# Altium project DRIVER.PrjPcb (part 2 of 4)

## Sheet 2_INTERFACES_EXTERNAS.SchDoc
size Tabloid; SheetNumber: 2; SheetTotal: 5; SPICEModelCacheOXJGALYG: <root> / <DocumentId>OXJGALYG</DocumentId> / <CacheFrame Number="0"> / <Model Name="0603_885012206052_1uf" Kind="CKT"> / <Text>******* / .subckt 0603_885012206052_1uF 1 2 / Rser 1 3 0.00742821402486 / Lser 2 4 2.51142993E-10 / C1 3 4 0.000001 / Rpar 3 4 100000000 / .ends 0603_885012206052_1uF</Text> / </Model> / </CacheFrame> / </root>
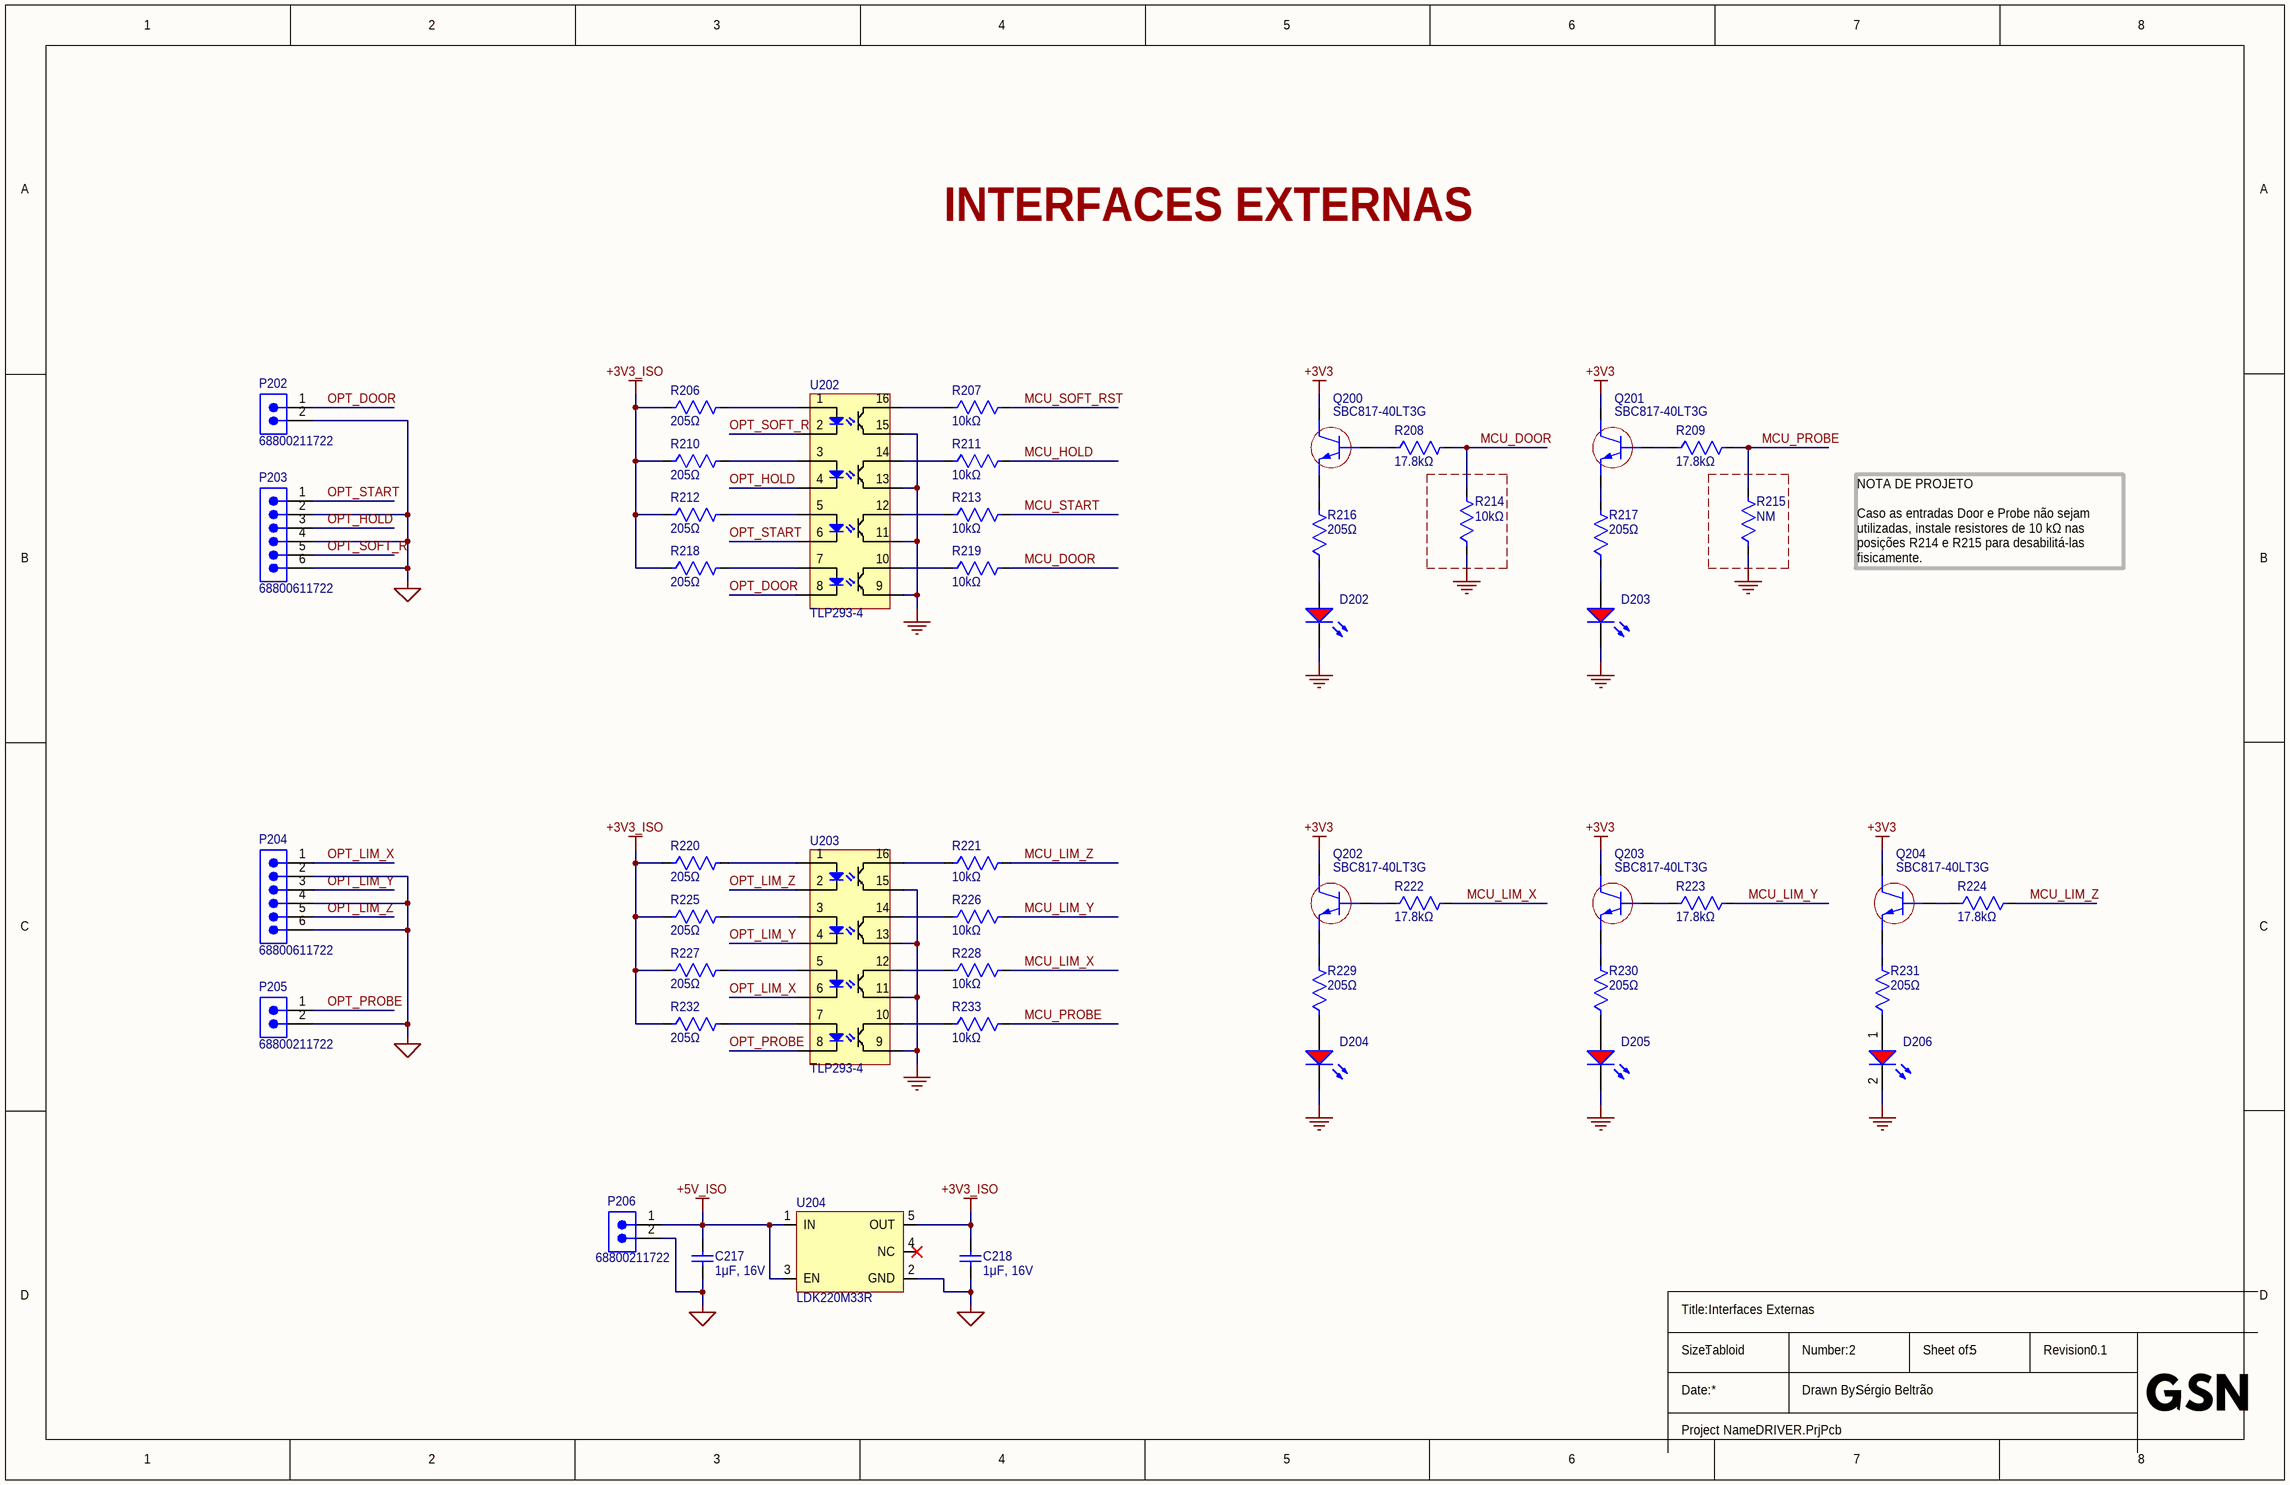
[diagram p1: 2_INTERFACES_EXTERNAS.SchDoc]

### Parts
C217  1μF, 16V  [WCAP-CSGP_0603_L1.6W0.8H0.8_Wave]
C218  1μF, 16V  [WCAP-CSGP_0603_L1.6W0.8H0.8_Wave]
D202  Red, 2V, 140deg  [WL-SMCW_0603_150060xx75003]  (value not drawn)
D203  Red, 2V, 140deg  [WL-SMCW_0603_150060xx75003]  (value not drawn)
D204  Red, 2V, 140deg  [WL-SMCW_0603_150060xx75003]  (value not drawn)
D205  Red, 2V, 140deg  [WL-SMCW_0603_150060xx75003]  (value not drawn)
D206  Red, 2V, 140deg  [WL-SMCW_0603_150060xx75003]  (value not drawn)
P202  68800211722  [68800211722]
P203  68800611722  [68800611722]
P204  68800611722  [68800611722]
P205  68800211722  [68800211722]
P206  68800211722  [68800211722]
Q200  SBC817-40LT3G  [SOT-23-3]
Q201  SBC817-40LT3G  [SOT-23-3]
Q202  SBC817-40LT3G  [SOT-23-3]
Q203  SBC817-40LT3G  [SOT-23-3]
Q204  SBC817-40LT3G  [SOT-23-3]
R206  205Ω  [0603-WAVE]
R207  10kΩ  [0603-WAVE]
R208  17.8kΩ  [0603-WAVE]
R209  17.8kΩ  [0603-WAVE]
R210  205Ω  [0603-WAVE]
R211  10kΩ  [0603-WAVE]
R212  205Ω  [0603-WAVE]
R213  10kΩ  [0603-WAVE]
R214  10kΩ  [0603-WAVE]
R215  NM  [0603-WAVE]
R216  205Ω  [0603-WAVE]
R217  205Ω  [0603-WAVE]
R218  205Ω  [0603-WAVE]
R219  10kΩ  [0603-WAVE]
R220  205Ω  [0603-WAVE]
R221  10kΩ  [0603-WAVE]
R222  17.8kΩ  [0603-WAVE]
R223  17.8kΩ  [0603-WAVE]
R224  17.8kΩ  [0603-WAVE]
R225  205Ω  [0603-WAVE]
R226  10kΩ  [0603-WAVE]
R227  205Ω  [0603-WAVE]
R228  10kΩ  [0603-WAVE]
R229  205Ω  [0603-WAVE]
R230  205Ω  [0603-WAVE]
R231  205Ω  [0603-WAVE]
R232  205Ω  [0603-WAVE]
R233  10kΩ  [0603-WAVE]
U202  TLP293-4  [SO-16]
U203  TLP293-4  [SO-16]
U204  LDK220M33R  [SOT-23-5]

### Nets
+3V3: Q200.3(C) Q201.3(C) Q202.3(C) Q203.3(C) Q204.3(C)
+3V3_ISO: C218.2 R206.1 R210.1 R212.1 R218.1 R220.1 R225.1 R227.1 R232.1 U204.5(OUT)
+5V_ISO: C217.2 P206.1 U204.1(IN) U204.3(EN)
GND: D202.2(K) D203.2(K) D204.2(K) D205.2(K) D206.2(K) R214.1 R215.1 U202.9 U202.11 U202.13 U202.15 U203.9 U203.11 U203.13 U203.15
GND_ISO: C217.1 C218.1 P202.2 P203.2 P203.4 P203.6 P204.2 P204.4 P204.6 P205.2 P206.2 U204.2(GND)
MCU_DOOR: R208.2 R214.2 R219.2
MCU_HOLD: R211.2
MCU_LIM_X: R222.2 R228.2
MCU_LIM_Y: R223.2 R226.2
MCU_LIM_Z: R221.2 R224.2
MCU_PROBE: R209.2 R215.2 R233.2
MCU_SOFT_RST: R207.2
MCU_START: R213.2
OPT_DOOR: P202.1 U202.8
OPT_HOLD: P203.3 U202.4
OPT_LIM_X: P204.1 U203.6
OPT_LIM_Y: P204.3 U203.4
OPT_LIM_Z: P204.5 U203.2
OPT_PROBE: P205.1 U203.8
OPT_SOFT_R: P203.5 U202.2
OPT_START: P203.1 U202.6
NetD202_1: D202.1(A) R216.1
NetD203_1: D203.1(A) R217.1
NetD204_1: D204.1(A) R229.1
NetD205_1: D205.1(A) R230.1
NetD206_1: D206.1(A) R231.1
NetQ200_1: Q200.1(B) R208.1
NetQ200_2: Q200.2(E) R216.2
NetQ201_1: Q201.1(B) R209.1
NetQ201_2: Q201.2(E) R217.2
NetQ202_1: Q202.1(B) R222.1
NetQ202_2: Q202.2(E) R229.2
NetQ203_1: Q203.1(B) R223.1
NetQ203_2: Q203.2(E) R230.2
NetQ204_1: Q204.1(B) R224.1
NetQ204_2: Q204.2(E) R231.2
NetR206_2: R206.2 U202.1
NetR207_1: R207.1 U202.16
NetR210_2: R210.2 U202.3
NetR211_1: R211.1 U202.14
NetR212_2: R212.2 U202.5
NetR213_1: R213.1 U202.12
NetR218_2: R218.2 U202.7
NetR219_1: R219.1 U202.10
NetR220_2: R220.2 U203.1
NetR221_1: R221.1 U203.16
NetR225_2: R225.2 U203.3
NetR226_1: R226.1 U203.14
NetR227_2: R227.2 U203.5
NetR228_1: R228.1 U203.12
NetR232_2: R232.2 U203.7
NetR233_1: R233.1 U203.10

Not connected (* = marked no-connect by the designer): U204 4(NC)*

### Notes on the sheet
- INTERFACES EXTERNAS
- NOTA DE PROJETO
  Caso as entradas Door e Probe não sejam utilizadas, instale resistores de 10 kΩ nas posições R214 e R215 para desabilitá-las fisicamente.
- Interfaces Externas
- Title:
- Size:
- Tabloid
- Number:
- Sheet of:
- Revision:
- Date:
- Project Name:
- Drawn By:

### Library data of the parts
C217 C218 = 885012206052: WCAP-CSGP Multilayer Ceramic Chip Capacitor, General Purpose, size 0603, 1μF, 16V; Manufacturer: Wurth Elektronik; Case/Size Code: 0603; Capacitance: 1uF; Capacitance Tolerance: +/-10%; Ceramic Type: X7R; Dissipation Factor: 10%; Insulation Resistance: 0.1Gohm; Technical Reference: X7R0603105K016DFCT10000; Manufacturer Part Number: 885012206052; Category: Multilayer Ceramic Chip Capacitors; Match Code: WCAP-CSGP; ComponentLink1Description: Website Link; ComponentLink1URL: https://www.we-online.com/redexpert/article/885012206052?ad; ComponentLink2Description: Datasheet Link; ComponentLink2URL: https://www.we-online.com/redexpert/spec/885012206052?ad; Mount: Surface Mount; Operating Temperature Min: -55degC; Operating Temperature Max: 125degC; Packaging: Tape and Reel; Length: 1.6mm; Width: 0.8mm; Height: 0.8mm; Rated Voltage (DC): 16V
D202-D206 = 150060RS75003: WL-SMCW Mono-color Chip LED Waterclear, SMT, size 0603, Red, 2V, 140°; Manufacturer: Wurth Elektronik; Case/Size Code: 0603; Chip Technology: AlInGaP; Dominant Wavelength: 625nm; Luminous Intensity: 530mcd; Peak Wavelength: 630nm; Manufacturer Part Number: 150060RS75003; Category: Signal LEDs; Match Code: WL-SMCW; ComponentLink1Description: Website Link; ComponentLink1URL: https://www.we-online.com/redexpert/article/150060RS75003?ad; ComponentLink2Description: Datasheet Link; ComponentLink2URL: https://www.we-online.com/redexpert/spec/150060RS75003?ad; Mount: Surface Mount; Packaging: Tape and Reel; Length: 1.6mm; Width: 0.8mm; Height: 0.7mm; Emitting Color: Red; Forward Voltage: 2V; Viewing Angle: 140deg; Operating Temperature Min: -40degC; Operating Temperature Max: 100degC
P202 P205 P206 = 68800211722: WR-WTB “J” Type THT Male Horizontal Shrouded Header, pitch 2.5 mm, 2 pins; Manufacturer: Wurth Elektronik; Contact Resistance: 20 mohm; Rated Current: 3 A; Working Voltage: 250 V(AC); Withstanding Voltage: 800 V(AC); Manufacturer Part Number: 68800211722; Category: Wire-to-Board Connector; Match Code: WR-WTB; ComponentLink1Description: Website Link; ComponentLink1URL: https://www.we-online.com/redexpert/article/68800211722?ad; ComponentLink2Description: Datasheet Link; ComponentLink2URL: https://www.we-online.com/redexpert/spec/68800211722?ad; Mount: Through Hole; Operating Temperature Min: -25degC; Operating Temperature Max: 85degC; Packaging: Bag; Length: 7.5 mm; Width: 8.3 mm; Height: 4.2 mm; Gender: Male; Number of Pins: 2; Number of Rows: 1; Orientation: Horizontal; Lead Pitch: 2.5 mm
P203 P204 = 68800611722: WR-WTB “J” Type THT Male Horizontal Shrouded Header, pitch 2.5 mm, 6 pins; Manufacturer: Wurth Elektronik; Contact Resistance: 20 mohm; Rated Current: 3 A; Working Voltage: 250 V(AC); Withstanding Voltage: 800 V(AC); Manufacturer Part Number: 68800611722; Category: Wire-to-Board Connector; Match Code: WR-WTB; ComponentLink1Description: Website Link; ComponentLink1URL: https://www.we-online.com/redexpert/article/68800611722?ad; ComponentLink2Description: Datasheet Link; ComponentLink2URL: https://www.we-online.com/redexpert/spec/68800611722?ad; Mount: Through Hole; Operating Temperature Min: -25degC; Operating Temperature Max: 85degC; Packaging: Bag; Length: 17.5 mm; Width: 8.3 mm; Height: 4.2 mm; Gender: Male; Number of Pins: 6; Number of Rows: 1; Orientation: Horizontal; Lead Pitch: 2.5 mm
Q200-Q204 = SBC817-40LT3G: TRANS NPN 45V 0.5A SOT23-3; Manufacturer: onsemi; Manufacturer Lifecycle Status: ACTIVE; Collector Base Voltage (VCBO): 50V; Continuous Collector Current: 500mA; Element Configuration: Single; Emitter Base Voltage (VEBO): 5V; Frequency: 100MHz; hFE Min: 250; Max Power Dissipation: 300mW; Number of Elements: 1; Supplier: DigiKey; Supplier Part Number: SBC817-40LT3GOSCT-ND; Manufacturer Part Number: SBC817-40LT3G; RoHS: Compliant; Category: BJTs; Stock: 144045; Pricing: 1=0.24, 10=0.146, 100=0.0904, 500=0.06616, 1000=0.05829, 2000=0.05165, 5000=0.04443 (USD); Case/Package: SOT-23-3; China RoHS: Compliant; Collector Emitter Breakdown Voltage: 45V; Collector Emitter Voltage (VCEO): 45V; Country of Origin: Mainland China; Export Control Classification Number (ECCN) Code: EAR99; Halogen Free: Halogen Free; Introduction Date: 1991-03-01; Lead Free: Lead Free; Lifecycle Status: Production; Max Breakdown Voltage: 45V; Max Collector Current: 500mA; Clock Frequency: 100MHz; Max Operating Temperature: 150°C; Min Operating Temperature: -55°C; Pins: 3; Number of Terminals: 3; Packaging: Tape and Reel; Polarity: NPN; Power Dissipation: 300mW; Radiation Hardening: No; REACH SVHC: Yes; Schedule B: 8541210080, 8541210080|8541210080, 8541210080|8541210080|8541210080, 8541210080|8541210080|8541210080|8541210080; Transition Frequency: 100MHz; ComponentLink1URL: https://datasheet.octopart.com:443/SBC817-40LT3G-onsemi-datasheet-175914671.pdf?src-supplier=IHS; ComponentLink1Description: https://datasheet.octopart.com:443/SBC817-40LT3G-onsemi-datasheet-175914671.pdf?src-supplier=IHS; ComponentLink2URL: https://datasheet.octopart.com:443/SBC817-40LT3G-ON-Semiconductor-datasheet-11547464.pdf?src-supplier=Upverter; ComponentLink2Description: https://datasheet.octopart.com:443/SBC817-40LT3G-ON-Semiconductor-datasheet-11547464.pdf?src-supplier=Upverter; ComponentLink3URL: https://datasheet.octopart.com:443/SBC817-40LT3G-ON-Semiconductor-datasheet-78758879.pdf?src-supplier=Master+Electronics; ComponentLink3Description: https://datasheet.octopart.com:443/SBC817-40LT3G-ON-Semiconductor-datasheet-78758879.pdf?src-supplier=Master+Electronics; ComponentLink4URL: https://datasheet.octopart.com:443/SBC817-40LT3G-onsemi-datasheet-189132499.pdf?src-supplier=Master+Electronics; ComponentLink4Description: https://datasheet.octopart.com:443/SBC817-40LT3G-onsemi-datasheet-189132499.pdf?src-supplier=Master+Electronics; ComponentLink5URL: https://datasheet.octopart.com:443/SBC817-40LT3G-ON-Semiconductor-datasheet-8110464.pdf?src-supplier=onsemi; ComponentLink5Description: https://datasheet.octopart.com:443/SBC817-40LT3G-ON-Semiconductor-datasheet-8110464.pdf?src-supplier=onsemi; ComponentLink6URL: https://datasheet.octopart.com:443/SBC817-40LT3G-ON-Semiconductor-datasheet-6400296.pdf?src-supplier=onsemi; ComponentLink6Description: https://datasheet.octopart.com:443/SBC817-40LT3G-ON-Semiconductor-datasheet-6400296.pdf?src-supplier=onsemi; ComponentLink7URL: https://datasheet.octopart.com:443/SBC817-40LT3G-onsemi-datasheet-133521192.pdf?src-supplier=TME; ComponentLink7Description: https://datasheet.octopart.com:443/SBC817-40LT3G-onsemi-datasheet-133521192.pdf?src-supplier=TME; ComponentLink8URL: http://sigma.octopart.com:80/15540786/rohs_certificate/ON-Semiconductor-SBC817-40LT3G.pdf?src-supplier=Compliance+Statements; ComponentLink8Description: http://sigma.octopart.com:80/15540786/rohs_certificate/ON-Semiconductor-SBC817-40LT3G.pdf?src-supplier=Compliance+Statements; ComponentLink9URL: http://sigma.octopart.com:80/15684525/materials_sheet/ON-Semiconductor-SBC817-40LT3G.csv?src-supplier=Compliance+Statements; ComponentLink9Description: http://sigma.octopart.com:80/15684525/materials_sheet/ON-Semiconductor-SBC817-40LT3G.csv?src-supplier=Compliance+Statements; ComponentLink10URL: http://sigma.octopart.com:80/150631289/rohs_statement/ON-Semiconductor-SBC817-40LT3G.pdf?src-supplier=Compliance+Statements; ComponentLink10Description: http://sigma.octopart.com:80/150631289/rohs_statement/ON-Semiconductor-SBC817-40LT3G.pdf?src-supplier=Compliance+Statements; ComponentLink11URL: http://sigma.octopart.com:80/reach_statement/ON-Semiconductor-company-79.pdf?src-supplier=Compliance+Statements; ComponentLink11Description: http://sigma.octopart.com:80/reach_statement/ON-Semiconductor-company-79.pdf?src-supplier=Compliance+Statements; ComponentLink12URL: https://octopart.com:443/opatz8j6/c1?t=cEC30QwZsyb0x-FMX1jhecc8cj0lODbyQVaJL5I4EOudI-i4uiyo8QJe7x8WGpb_UfldyhXdI6wTsOpeJ5HWz7Kzleo1EiYpUhSwBawIenFlUCJsMQESd9nlIcVrbvWrabnb6HpXCtvxDkswRDKZDOG3MBWymJDy-mDPZ7u5UlptsX8-ONvWANeBowi-w7nz9iZWLyjqVoM_QTKEQgTILpDidA8CXVyMync_ukwLaadxciX7hbgDafM4N20bPQPEg7z2Sm1KwG15cEibpJqtQ1hKuQpn-edZc_o2ddvdnsTvT3gddPA_45tVxaNa9XWOJj00WFdTbgFSlU6TTFEybWVRRlK52823bHwN5uVZ-7M&src-supplier=Compliance+Statements; ComponentLink12Description: https://octopart.com:443/opatz8j6/c1?t=cEC30QwZsyb0x-FMX1jhecc8cj0lODbyQVaJL5I4EOudI-i4uiyo8QJe7x8WGpb_UfldyhXdI6wTsOpeJ5HWz7Kzleo1EiYpUhSwBawIenFlUCJsMQESd9nlIcVrbvWrabnb6HpXCtvxDkswRDKZDOG3MBWymJDy-mDPZ7u5UlptsX8-ONvWANeBowi-w7nz9iZWLyjqVoM_QTKEQgTILpDidA8CXVyMync_ukwLaadxciX7hbgDafM4N20bPQPEg7z2Sm1KwG15cEibpJqtQ1hKuQpn-edZc_o2ddvdnsTvT3gddPA_45tVxaNa9XWOJj00WFdTbgFSlU6TTFEybWVRRlK52823bHwN5uVZ-7M&src-supplier=Compliance+Statements; ComponentLink13URL: https://octopart.com:443/opatz8j6/c1?t=zgMoQUE-FAGizIL2uNADbP3CQfJXduVKNLOt0cT-C7XNOnl5EOgq1b4UVzb0SZjomH3a3CKF513mPEsnVuWFTldNModuoiOAROM-U7UMjU1TiA4JeYDoVNfia-psQDQPr2NtqLaOU9Ju06PrsXVFYjz3NjgsSVJa-5X9CcWQ1HPxPGGUjhKccWy9QJVPTcefUdorkFOZvdb3XFmpP_42jgzyR9ZUQAURqjwANTg96Z5ittV_NTML0IEyFPhh0jLh0am3ICJpb8VA9ph6AsqLc9j4fhdilqUiQTpG4UGLijUcgX0mpfEUR-9G0JRIiKjoFhJPWB3BEKd5JcwsK41biiNJ-0hjTcgtgsqlWYFFTPLS&src-supplier=Compliance+Statements; ComponentLink13Description: https://octopart.com:443/opatz8j6/c1?t=zgMoQUE-FAGizIL2uNADbP3CQfJXduVKNLOt0cT-C7XNOnl5EOgq1b4UVzb0SZjomH3a3CKF513mPEsnVuWFTldNModuoiOAROM-U7UMjU1TiA4JeYDoVNfia-psQDQPr2NtqLaOU9Ju06PrsXVFYjz3NjgsSVJa-5X9CcWQ1HPxPGGUjhKccWy9QJVPTcefUdorkFOZvdb3XFmpP_42jgzyR9ZUQAURqjwANTg96Z5ittV_NTML0IEyFPhh0jLh0am3ICJpb8VA9ph6AsqLc9j4fhdilqUiQTpG4UGLijUcgX0mpfEUR-9G0JRIiKjoFhJPWB3BEKd5JcwsK41biiNJ-0hjTcgtgsqlWYFFTPLS&src-supplier=Compliance+Statements
R206 R210 R212 R216-R218 R220 R225 R227 R229-R232 = RC0603FR-07205RL: RES 205 OHM 1% 1/10W 0603; Manufacturer: Yageo Group; Max Power Dissipation: 100mW; Temperature Coefficient: ±200ppm/°C; Voltage Rating (AC): 50V; Voltage Rating: 75V; Supplier Part Number: 311-205HRCT-ND; Manufacturer Part Number: RC0603FR-07205RL; Value: 205Ω; Case Code (Imperial): 0603; Case Code (Metric): 1608; Case/Package: 0603; Category: Chip SMD Resistors; China RoHS: Non-Compliant; Composition: Thick Film; Contact Plating: Tin; Depth: 800µm; Features: Moisture Resistant; Height: 450µm; Lead Free: Lead Free; Length: 1.6mm; Lifecycle Status: Production; Max Operating Temperature: 155°C; Military Standard: Not; Min Operating Temperature: -55°C; Mounting Technology: Surface Mount; Number of Terminals: 2; Number of Terminations: 2; Packaging: Tape & Reel; Power Dissipation: 100mW; Power Rating: 100mW; Radiation Hardening: No; REACH SVHC: Yes; RoHS: Compliant; Supplier: DigiKey; Termination: SMD/SMT; Tolerance: 1%; Component Link Description: https://www.yageogroup.com/content/datasheet/asset/file/PYU-RC_GROUP_51_ROHS_L; Component Link URL: https://www.yageogroup.com/content/datasheet/asset/file/PYU-RC_GROUP_51_ROHS_L; Datasheet: https://www.yageogroup.com/content/datasheet/asset/file/PYU-RC_GROUP_51_ROHS_L; Voltage Rating (DC): 50V; Weight: 2.012816mg; Width: 800µm; Working Voltage: 75V
R207 R211 R213-R215 R219 R221 R226 R228 R233 = RC0603FR-0710KL: RES 10K OHM 1% 1/10W 0603; Manufacturer: Yageo Group; Max Power Dissipation: 100mW; Temperature Coefficient: ±200ppm/°C; Voltage Rating (AC): 50V; Voltage Rating: 75V; Supplier Part Number: 311-10.0KHRCT-ND; Manufacturer Part Number: RC0603FR-0710KL; Case Code (Imperial): 0603; Case Code (Metric): 1608; Case/Package: 0603; Category: Chip SMD Resistors; China RoHS: Non-Compliant; Composition: Thick Film; Contact Plating: Tin; Depth: 800µm; Features: Moisture Resistant; Height: 450µm; Lead Free: Lead Free; Length: 1.6mm; Lifecycle Status: Production; Max Operating Temperature: 155°C; Military Standard: Not; Min Operating Temperature: -55°C; Mounting Technology: Surface Mount; Number of Terminals: 2; Number of Terminations: 2; Packaging: Tape & Reel; Power Dissipation: 100mW; Power Rating: 100mW; Radiation Hardening: No; REACH SVHC: Yes; RoHS: Compliant; Supplier: DigiKey; Termination: SMD/SMT; Tolerance: 1%; Component Link Description: https://www.yageogroup.com/content/datasheet/asset/file/PYU-RC_GROUP_51_ROHS_L; Component Link URL: https://www.yageogroup.com/content/datasheet/asset/file/PYU-RC_GROUP_51_ROHS_L; Datasheet: https://www.yageogroup.com/content/datasheet/asset/file/PYU-RC_GROUP_51_ROHS_L; Voltage Rating (DC): 50V; Weight: 2.012816mg; Width: 800µm; Working Voltage: 75V
  R207 R211 R213 R214 R219 R221 R226 R228 R233: Value: 10kΩ
  R215: Value: NM
R208 R209 R222-R224 = RC0603FR-0717K8L: RES 17.8K OHM 1% 1/10W 0603; Manufacturer: Yageo Group; Max Power Dissipation: 100mW; Temperature Coefficient: ±200ppm/°C; Voltage Rating (AC): 50V; Voltage Rating: 75V; Supplier Part Number: 311-17.8KHRCT-ND; Manufacturer Part Number: RC0603FR-0717K8L; Value: 17.8kΩ; Case Code (Imperial): 0603; Case Code (Metric): 1608; Case/Package: 0603; Category: Chip SMD Resistors; China RoHS: Non-Compliant; Composition: Thick Film; Contact Plating: Tin; Depth: 800µm; Features: Moisture Resistant; Height: 450µm; Lead Free: Lead Free; Length: 1.6mm; Lifecycle Status: Production; Max Operating Temperature: 155°C; Military Standard: Not; Min Operating Temperature: -55°C; Mounting Technology: Surface Mount; Number of Terminals: 2; Number of Terminations: 2; Packaging: Tape & Reel; Power Dissipation: 100mW; Power Rating: 100mW; Radiation Hardening: No; REACH SVHC: Yes; RoHS: Compliant; Supplier: DigiKey; Termination: SMD/SMT; Tolerance: 1%; Component Link Description: https://www.yageogroup.com/content/datasheet/asset/file/PYU-RC_GROUP_51_ROHS_L; Component Link URL: https://www.yageogroup.com/content/datasheet/asset/file/PYU-RC_GROUP_51_ROHS_L; Datasheet: https://www.yageogroup.com/content/datasheet/asset/file/PYU-RC_GROUP_51_ROHS_L; Voltage Rating (DC): 50V; Weight: 2.012816mg; Width: 800µm; Working Voltage: 75V
U202 U203 = TLP293-4: OPTOISO 3.75KV 4CH TRANS 16-SO; Manufacturer: Toshiba; Manufacturer Part Number: TLP293-4(TP,E; Collector Emitter Breakdown Voltage: 80V; Collector Emitter Saturation Voltage: 300mV; Current Transfer Ratio: 50%; Dark Current: 80nA; Forward Current: 50mA; Forward Voltage: 1.4V; Max Junction Temperature (Tj): 125°C; Max Power Dissipation: 100mW; Number of Channels: 4; Turn-Off Delay Time: 3µs; Supplier: DigiKey; Supplier Part Number: TLP293-4(TPECT-ND; RoHS: Compliant; Category: Optocouplers; Stock: 42408; Pricing: 1=1.54, 10=1.093, 100=0.8233, 500=0.704, 1000=0.66505 (USD); Case/Package: SOIC; Collector Emitter Voltage (VCEO): 300mV; Height: 2.3mm; Isolation Voltage: 3.75kV; Lifecycle Status: Production; Max Operating Temperature: 125°C; Max Output Voltage: 80V; Min Operating Temperature: -55°C; Mounting Technology: Surface Mount; Number of Elements: 4; Pins: 16; Output Current per Channel: 50mA; Packaging: Tape & Reel (TR); REACH SVHC: Yes; Schedule B: 8541408000, 8541408000|8541408000|8541408000|8541408000|8541408000; Turn-On Delay Time: 3µs; ComponentLink1URL: https://datasheet.octopart.com:443/TLP293-4%28TP%2CE-Toshiba-datasheet-165584699.pdf?src-supplier=IHS; ComponentLink1Description: https://datasheet.octopart.com:443/TLP293-4%28TP%2CE-Toshiba-datasheet-165584699.pdf?src-supplier=IHS; ComponentLink2URL: https://datasheet.octopart.com:443/TLP293-4%28TP%2CE-Toshiba-datasheet-62096132.pdf?src-supplier=Upverter; ComponentLink2Description: https://datasheet.octopart.com:443/TLP293-4%28TP%2CE-Toshiba-datasheet-62096132.pdf?src-supplier=Upverter
U204 = LDK220M33R: IC REG LINEAR 3.3V 200MA SOT23-5; Manufacturer: STMicroelectronics; Accuracy: 2%; Dropout Voltage: 200mV; Max Supply Voltage: 13.2V; Max Junction Temperature (Tj): 125°C; Max Power Dissipation: 500mW; Min Input Voltage: 4.3V; Number of Channels: 1; Output Type: Fixed; Polarity: Positive; Quiescent Current: 60µA; Voltage Tolerance: 3%; Supplier: DigiKey; Supplier Part Number: 497-14824-1-ND; Manufacturer Part Number: LDK220M33R; RoHS: Compliant; Category: LDO Voltage Regulators; Stock: 13215; Pricing: 1=0.39, 10=0.268, 25=0.2388, 100=0.2061, 250=0.1906, 500=0.18124, 1000=0.17353 (USD); Case/Package: LSSOP; China RoHS: Compliant; Contact Plating: Tin; Country of Origin: Mainland China; Export Control Classification Number (ECCN) Code: EAR99; Height: 1mm; Height - Seated (Max): 1.45mm; Harmonized Tariff Schedule (HTS) Code: 8542.39.00.60; Introduction Date: 2014-03-19; Lead Free: Lead Free; Length: 2.95mm; Lifecycle Status: Production; Max Operating Temperature: 125°C; Max Output current: 200mA; Min Operating Temperature: -40°C; Mounting Technology: Surface Mount; Nominal Output Voltage: 3.3V; Number of Circuits: 1; Number of Outputs: 1; Pins: 5; Number of Regulators: 1; Number of Terminals: 5; Output Current: 200mA; Output Voltage: 3.3V; Packaging: Cut Tape; Radiation Hardening: No; REACH SVHC: Yes; Schedule B: 8542390000, 8542390000|8542390000|8542390000|8542390000|8542390000; Terminal Pitch: 950µm; Weight: 29.993795mg; Width: 1.6mm; ComponentLink1URL: https://datasheet.octopart.com:443/LDK220M33R-STMicroelectronics-datasheet-164563982.pdf?src-supplier=IHS; ComponentLink1Description: https://datasheet.octopart.com:443/LDK220M33R-STMicroelectronics-datasheet-164563982.pdf?src-supplier=IHS; ComponentLink2URL: https://datasheet.octopart.com:443/LDK220M33R-STMicroelectronics-datasheet-44506895.pdf?src-supplier=element14+APAC; ComponentLink2Description: https://datasheet.octopart.com:443/LDK220M33R-STMicroelectronics-datasheet-44506895.pdf?src-supplier=element14+APAC; ComponentLink3URL: https://datasheet.octopart.com:443/LDK220M33R-STMicroelectronics-datasheet-24910216.pdf?src-supplier=Future+Electronics; ComponentLink3Description: https://datasheet.octopart.com:443/LDK220M33R-STMicroelectronics-datasheet-24910216.pdf?src-supplier=Future+Electronics; ComponentLink4URL: https://datasheet.octopart.com:443/LDK220M33R-STMicroelectronics-datasheet-36991664.pdf?src-supplier=Newark; ComponentLink4Description: https://datasheet.octopart.com:443/LDK220M33R-STMicroelectronics-datasheet-36991664.pdf?src-supplier=Newark; ComponentLink5URL: https://datasheet.octopart.com:443/LDK220M33R-STMicroelectronics-datasheet-101746762.pdf?src-supplier=Augswan; ComponentLink5Description: https://datasheet.octopart.com:443/LDK220M33R-STMicroelectronics-datasheet-101746762.pdf?src-supplier=Augswan

## Sheet 3_INTERFACE_DOS_DRIVERS.SchDoc
size Tabloid; SheetNumber: 3; SheetTotal: 5; SPICEModelCacheFCVACYYO: <root> / <DocumentId>FCVACYYO</DocumentId> / </root>
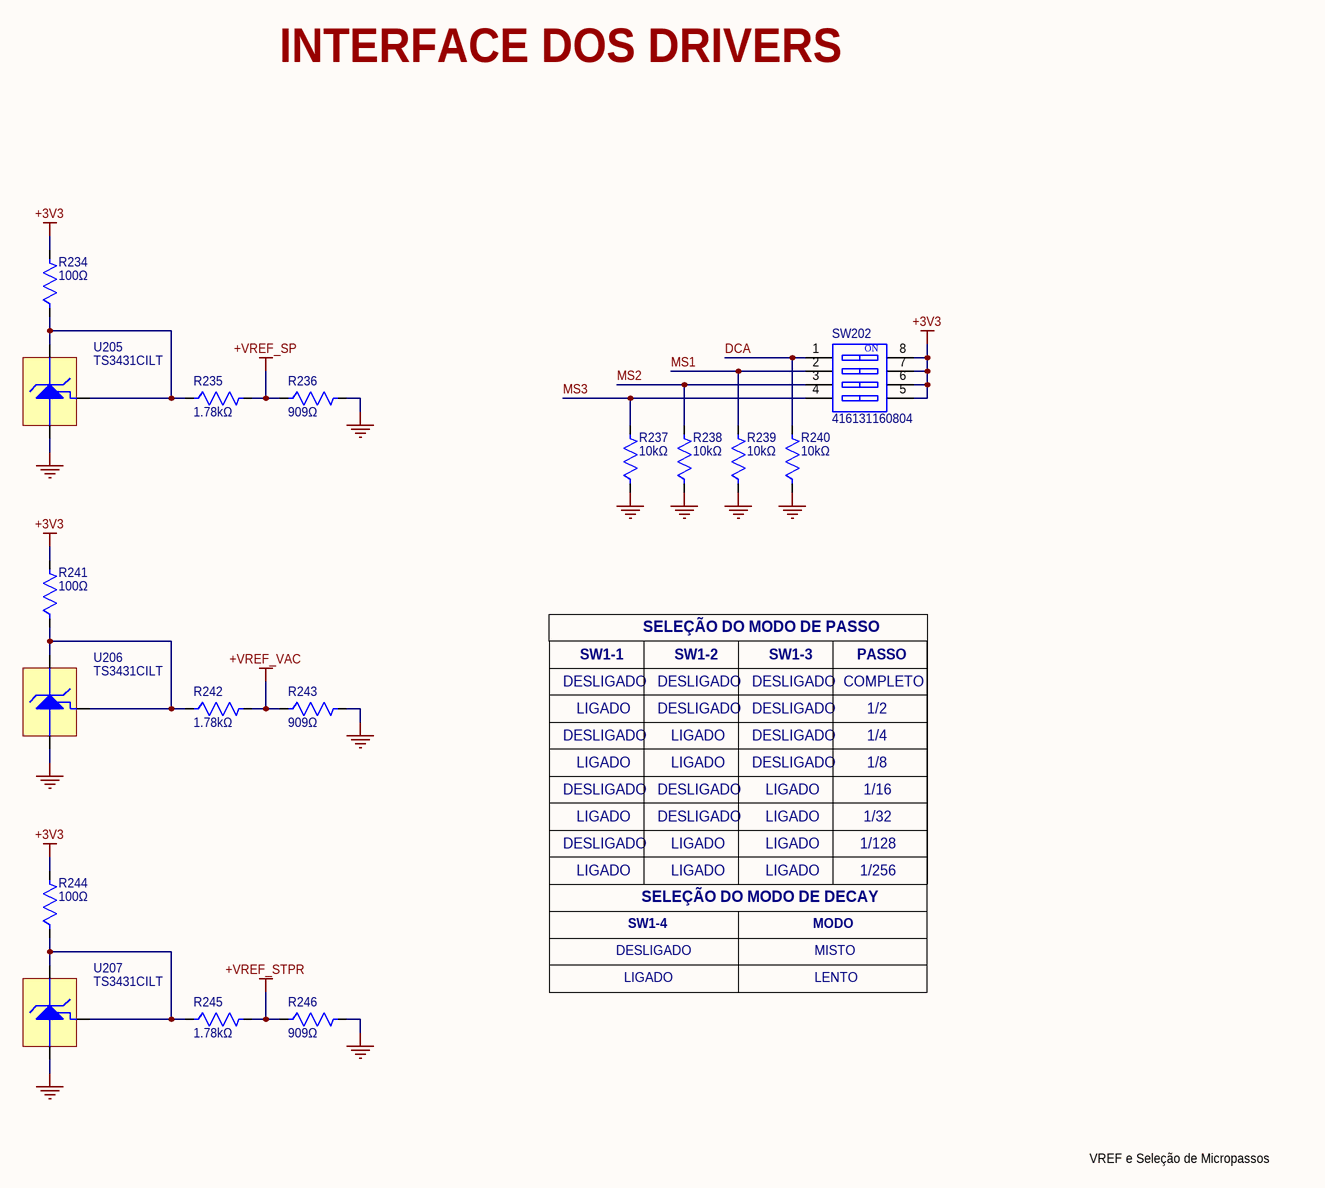
[diagram p2: 3_INTERFACE_DOS_DRIVERS.SchDoc]

### Parts
R234  100Ω  [0603-WAVE]
R235  1.78kΩ  [0603-WAVE]
R236  909Ω  [0603-WAVE]
R237  10kΩ  [0603-WAVE]
R238  10kΩ  [0603-WAVE]
R239  10kΩ  [0603-WAVE]
R240  10kΩ  [0603-WAVE]
R241  100Ω  [0603-WAVE]
R242  1.78kΩ  [0603-WAVE]
R243  909Ω  [0603-WAVE]
R244  100Ω  [0603-WAVE]
R245  1.78kΩ  [0603-WAVE]
R246  909Ω  [0603-WAVE]
SW202  416131160804  [416131160804]
U205  TS3431CILT  [SOT-23-3]
U206  TS3431CILT  [SOT-23-3]
U207  TS3431CILT  [SOT-23-3]

### Nets
+3V3: R234.2 R241.2 R244.2 SW202.5 SW202.6 SW202.7 SW202.8
+VREF_SP: R235.2 R236.1
+VREF_STPR: R245.2 R246.1
+VREF_VAC: R242.2 R243.1
GND: R236.2 R237.1 R238.1 R239.1 R240.1 R243.2 R246.2 U205.3(ANODE) U206.3(ANODE) U207.3(ANODE)
DCA: R240.2 SW202.1
MS1: R239.2 SW202.2
MS2: R238.2 SW202.3
MS3: R237.2 SW202.4
NetR234_1: R234.1 R235.1 U205.1(REF) U205.2(CATHODE)
NetR241_1: R241.1 R242.1 U206.1(REF) U206.2(CATHODE)
NetR244_1: R244.1 R245.1 U207.1(REF) U207.2(CATHODE)

### Notes on the sheet
- INTERFACE DOS DRIVERS
- SW1-1
- SELEÇÃO DO MODO DE PASSO
- SW1-2
- SW1-3
- PASSO
- DESLIGADO
- LIGADO
- COMPLETO
- 1/2
- 1/4
- 1/16
- 1/8
- 1/128
- 1/256
- 1/32
- SW1-4
- SELEÇÃO DO MODO DE DECAY
- MODO
- LENTO
- MISTO
- VREF e Seleção de Micropassos
- Title:
- Size:
- Tabloid
- Number:
- Sheet of:
- Revision:
- Date:
- Project Name:
- Drawn By:
- (in symbol 416131160804) ON

### Library data of the parts
R234 R241 R244 = RC0603FR-07100RL: RES 100 OHM 1% 1/10W 0603; Manufacturer: Yageo Group; Max Power Dissipation: 100mW; Temperature Coefficient: ±200ppm/°C; Voltage Rating (AC): 50V; Voltage Rating: 75V; Supplier Part Number: 311-100HRCT-ND; Manufacturer Part Number: RC0603FR-07100RL; Value: 100Ω; Case Code (Imperial): 0603; Case Code (Metric): 1608; Case/Package: 0603; Category: Chip SMD Resistors; China RoHS: Non-Compliant; Composition: Thick Film; Contact Plating: Tin; Depth: 800µm; Features: Moisture Resistant; Height: 450µm; Lead Free: Lead Free; Length: 1.6mm; Lifecycle Status: Production; Max Operating Temperature: 155°C; Military Standard: Not; Min Operating Temperature: -55°C; Mounting Technology: Surface Mount; Number of Terminals: 2; Number of Terminations: 2; Packaging: Tape & Reel; Power Dissipation: 100mW; Power Rating: 100mW; Radiation Hardening: No; REACH SVHC: Yes; RoHS: Compliant; Supplier: DigiKey; Termination: SMD/SMT; Tolerance: 1%; Component Link Description: https://www.yageogroup.com/content/datasheet/asset/file/PYU-RC_GROUP_51_ROHS_L; Component Link URL: https://www.yageogroup.com/content/datasheet/asset/file/PYU-RC_GROUP_51_ROHS_L; Datasheet: https://www.yageogroup.com/content/datasheet/asset/file/PYU-RC_GROUP_51_ROHS_L; Voltage Rating (DC): 50V; Weight: 2.012816mg; Width: 800µm; Working Voltage: 75V
R235 R242 R245 = RC0603FR-071K78L: RES 1.78K OHM 1% 1/10W 0603; Manufacturer: Yageo Group; Max Power Dissipation: 100mW; Temperature Coefficient: ±200ppm/°C; Voltage Rating (AC): 50V; Voltage Rating: 75V; Supplier Part Number: 311-1.78KHRCT-ND; Manufacturer Part Number: RC0603FR-071K78L; Value: 1.78kΩ; Case Code (Imperial): 0603; Case Code (Metric): 1608; Case/Package: 0603; Category: Chip SMD Resistors; China RoHS: Non-Compliant; Composition: Thick Film; Contact Plating: Tin; Depth: 800µm; Features: Moisture Resistant; Height: 450µm; Lead Free: Lead Free; Length: 1.6mm; Lifecycle Status: Production; Max Operating Temperature: 155°C; Military Standard: Not; Min Operating Temperature: -55°C; Mounting Technology: Surface Mount; Number of Terminals: 2; Number of Terminations: 2; Packaging: Tape & Reel; Power Dissipation: 100mW; Power Rating: 100mW; Radiation Hardening: No; REACH SVHC: Yes; RoHS: Compliant; Supplier: DigiKey; Termination: SMD/SMT; Tolerance: 1%; Component Link Description: https://www.yageogroup.com/content/datasheet/asset/file/PYU-RC_GROUP_51_ROHS_L; Component Link URL: https://www.yageogroup.com/content/datasheet/asset/file/PYU-RC_GROUP_51_ROHS_L; Datasheet: https://www.yageogroup.com/content/datasheet/asset/file/PYU-RC_GROUP_51_ROHS_L; Voltage Rating (DC): 50V; Weight: 2.012816mg; Width: 800µm; Working Voltage: 75V
R236 R243 R246 = RC0603FR-07909RL: RES 909 OHM 1% 1/10W 0603; Manufacturer: Yageo Group; Max Power Dissipation: 100mW; Temperature Coefficient: ±200ppm/°C; Voltage Rating (AC): 50V; Voltage Rating: 75V; Supplier Part Number: 311-909HRCT-ND; Manufacturer Part Number: RC0603FR-07909RL; Value: 909Ω; Case Code (Imperial): 0603; Case Code (Metric): 1608; Case/Package: 0603; Category: Chip SMD Resistors; China RoHS: Non-Compliant; Composition: Thick Film; Contact Plating: Tin; Depth: 800µm; Features: Moisture Resistant; Height: 450µm; Lead Free: Lead Free; Length: 1.6mm; Lifecycle Status: Production; Max Operating Temperature: 155°C; Military Standard: Not; Min Operating Temperature: -55°C; Mounting Technology: Surface Mount; Number of Terminals: 2; Number of Terminations: 2; Packaging: Tape & Reel; Power Dissipation: 100mW; Power Rating: 100mW; Radiation Hardening: No; REACH SVHC: Yes; RoHS: Compliant; Supplier: DigiKey; Termination: SMD/SMT; Tolerance: 1%; Component Link Description: https://www.yageogroup.com/content/datasheet/asset/file/PYU-RC_GROUP_51_ROHS_L; Component Link URL: https://www.yageogroup.com/content/datasheet/asset/file/PYU-RC_GROUP_51_ROHS_L; Datasheet: https://www.yageogroup.com/content/datasheet/asset/file/PYU-RC_GROUP_51_ROHS_L; Voltage Rating (DC): 50V; Weight: 2.012816mg; Width: 800µm; Working Voltage: 75V
R237-R240 = RC0603FR-0710KL: as R207 on sheet 2_INTERFACES_EXTERNAS; Supplier Part Number: 311-10.0KHRCT-ND; Manufacturer Part Number: RC0603FR-0710KL; Value: 10kΩ; Case Code (Imperial): 0603; Case Code (Metric): 1608; Case/Package: 0603; Category: Chip SMD Resistors; China RoHS: Non-Compliant; Composition: Thick Film; Contact Plating: Tin; Depth: 800µm; Features: Moisture Resistant; Height: 450µm; Lead Free: Lead Free; Length: 1.6mm; Lifecycle Status: Production; Max Operating Temperature: 155°C; Military Standard: Not; Min Operating Temperature: -55°C; Mounting Technology: Surface Mount; Number of Terminals: 2; Number of Terminations: 2; Packaging: Tape & Reel; Power Dissipation: 100mW; Power Rating: 100mW; Radiation Hardening: No; REACH SVHC: Yes; RoHS: Compliant; Supplier: DigiKey; Termination: SMD/SMT; Tolerance: 1%; Component Link Description: https://www.yageogroup.com/content/datasheet/asset/file/PYU-RC_GROUP_51_ROHS_L; Component Link URL: https://www.yageogroup.com/content/datasheet/asset/file/PYU-RC_GROUP_51_ROHS_L; Datasheet: https://www.yageogroup.com/content/datasheet/asset/file/PYU-RC_GROUP_51_ROHS_L; Voltage Rating (DC): 50V; Weight: 2.012816mg; Width: 800µm; Working Voltage: 75V
SW202 = 416131160804: WS-DISV Small Compact SMD Dip Switch, Flat Actuator with Top Tape, pitch 1.27mm, 4p; Manufacturer: Wurth Elektronik; Actuator Type: Flat Type; Operation Force: 500g; Number of Poles: 4; Rated Current Non-Switching: 100mA; Rated Current Switching: 25mA; Rated Voltage Non-Switching: 50VDC; Rated Voltage Switching: 24VDC; Manufacturer Part Number: 416131160804; Category: Dip Switches; Match Code: WS-DISV; ComponentLink1Description: Website Link; ComponentLink1URL: https://www.we-online.com/redexpert/article/416131160804?ad; ComponentLink2Description: Datasheet Link; ComponentLink2URL: https://www.we-online.com/redexpert/spec/416131160804?ad; Mount: Surface Mount; Operating Temperature Min: -40degC; Operating Temperature Max: 85degC; Packaging: Tape and Reel; Contact Material: Copper Alloy; Contact Plating: Gold; Pitch: 1.27mm
U205-U207 = TS3431CILT: IC VREF SHUNT ADJ 0.25% SOT23-3; Manufacturer: STMicroelectronics; Cathode Current: 400µA; Max Supply Voltage: 25V; Max Output current: 100mA; Max Output Voltage: 1.243V; Min Output Voltage: 1.237V; Min Supply Voltage: 1.24V; Number of Channels: 1; Output Voltage: 24V; Reference Type: Adjustable, Shunt; Temperature Coefficient: 100ppm/°C; Supplier: DigiKey; Supplier Part Number: 497-4637-1-ND; Manufacturer Part Number: TS3431CILT; RoHS: Compliant; Category: Voltage References; Stock: 16066; Pricing: 1=0.62, 10=0.44, 25=0.3944, 100=0.3441, 250=0.32016, 500=0.30574, 1000=0.29386 (USD); Case/Package: SOT-23; China RoHS: Compliant; Height: 1.02mm; Height - Seated (Max): 1.12mm; Lead Free: Lead Free; Length: 2.9mm; Lifecycle Status: Production; Max Operating Temperature: 125°C; Min Operating Temperature: -40°C; Mounting Technology: Surface Mount; Nominal Supply Voltage: 1.24V; Nominal Output Voltage: 1.24V; Nominal Supply Current: 400µA; Number of Circuits: 1; Number of Outputs: 1; Pins: 3; Number of Terminals: 3; Output Current: 100mA; Packaging: Tape and Reel; Radiation Hardening: No; REACH SVHC: Yes; Reference Voltage: 1.24V; Schedule B: 8542390000, 8542390000|8542390000|8542390000|8542390000|8542390000; Terminal Pitch: 950µm; Termination: SMD/SMT; Tolerance: 0.25%; Width: 1.3mm; ComponentLink1URL: https://datasheet.octopart.com:443/TS3431CILT-STMicroelectronics-datasheet-12523092.pdf?src-supplier=SHENGYU+ELECTRONICS; ComponentLink1Description: https://datasheet.octopart.com:443/TS3431CILT-STMicroelectronics-datasheet-12523092.pdf?src-supplier=SHENGYU+ELECTRONICS; ComponentLink2URL: https://datasheet.octopart.com:443/TS3431CILT-STMicroelectronics-datasheet-10408717.pdf?src-supplier=Upverter; ComponentLink2Description: https://datasheet.octopart.com:443/TS3431CILT-STMicroelectronics-datasheet-10408717.pdf?src-supplier=Upverter; ComponentLink3URL: https://datasheet.octopart.com:443/TS3431CILT-STMicroelectronics-datasheet-124172.pdf?src-supplier=Farnell; ComponentLink3Description: https://datasheet.octopart.com:443/TS3431CILT-STMicroelectronics-datasheet-124172.pdf?src-supplier=Farnell; ComponentLink4URL: https://datasheet.octopart.com:443/TS3431CILT-STMicroelectronics-datasheet-140368796.pdf?src-supplier=TME; ComponentLink4Description: https://datasheet.octopart.com:443/TS3431CILT-STMicroelectronics-datasheet-140368796.pdf?src-supplier=TME; ComponentLink5URL: https://datasheet.octopart.com:443/TS3431CILT-STMicroelectronics-datasheet-18487.pdf?src-supplier=DigiKey; ComponentLink5Description: https://datasheet.octopart.com:443/TS3431CILT-STMicroelectronics-datasheet-18487.pdf?src-supplier=DigiKey